# Altium schematic sheet lora1280m.SchDoc
size A4; SheetNumber: 1; SheetTotal: 1
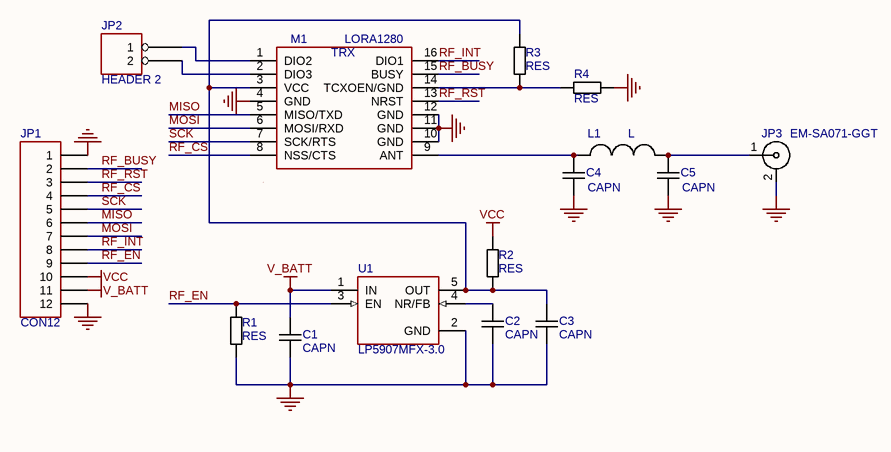
[diagram p0: lora1280m.SchDoc]

## Parts
C1  CAPN  [C-0805]
C2  CAPN  [C-0603]
C3  CAPN  [C-0805]
C4  CAPN  [C-0603]
C5  CAPN  [C-0603]
JP1  CON12  [PBS1-12R]
JP2  HEADER 2  [PLS1-2]
JP3  EM-SA071-GGT  [SMA_F_EDGE]
L1  L  [L-0603]
M1  LORA1280  [LGA16_LORA1280]
R1  RES  [R-0603]
R2  RES  [R-0603]
R3  RES  [R-0603]
R4  RES  [R-0603]
U1  LP5907MFX-3.0  [SOT-23-5]

## Nets
GND: C1.2 C2.2 C3.2 C4.2 C5.2 JP1.1 JP1.12 JP3.2 M1.4(GND) M1.10(GND) M1.11(GND) M1.12(GND) R1.1 R4.1 U1.2(GND)
V_BATT: C1.1 JP1.11 U1.1(IN)
VCC: JP1.10 R2.2
MISO: JP1.6 M1.5(MISO/TXD)
MOSI: JP1.7 M1.6(MOSI/RXD)
RF_BUSY: JP1.2 M1.15(BUSY)
RF_CS: JP1.4 M1.8(NSS/CTS)
RF_EN: JP1.9 R1.2 U1.3(EN)
RF_INT: JP1.8 M1.16(DIO1)
RF_RST: JP1.3 M1.13(NRST)
SCK: JP1.5 M1.7(SCK/RTS)
NetC2_1: C2.1 U1.4(NR/FB)
NetC3_1: C3.1 M1.3(VCC) R2.1 R3.1 U1.5(OUT)
NetC4_1: C4.1 L1.1 M1.9(ANT)
NetC5_1: C5.1 JP3.1 L1.2
NetJP2_1: JP2.1 M1.1(DIO2)
NetJP2_2: JP2.2 M1.2(DIO3)
NetM1_14: M1.14(TCXOEN/GND) R3.2 R4.2

## Notes on the sheet
- (in symbol LORA1280) TRX

## Library data of the parts
C1-C5 = CAPN: Voltage: 50V; Точність/група: NP0; Вид: Конденсатор
JP1 = CON12: Connector; Вид: Роз'єм; *: *
JP2 = HEADER 2: Вид: Роз'єм; *: *
JP3 = SMA: SMA Female R/A PCB Mount; Вид: Роз'єм
L1 = L: Вид: Індуктивність
R1-R4 = RES: Точність/група: 5%; Вид: Резистор
U1 = LP5907: 250mA Low-Dropout Regulator; Вид: Мікросхема